# EAGLE design GPS (EAGLE 7.7.0)
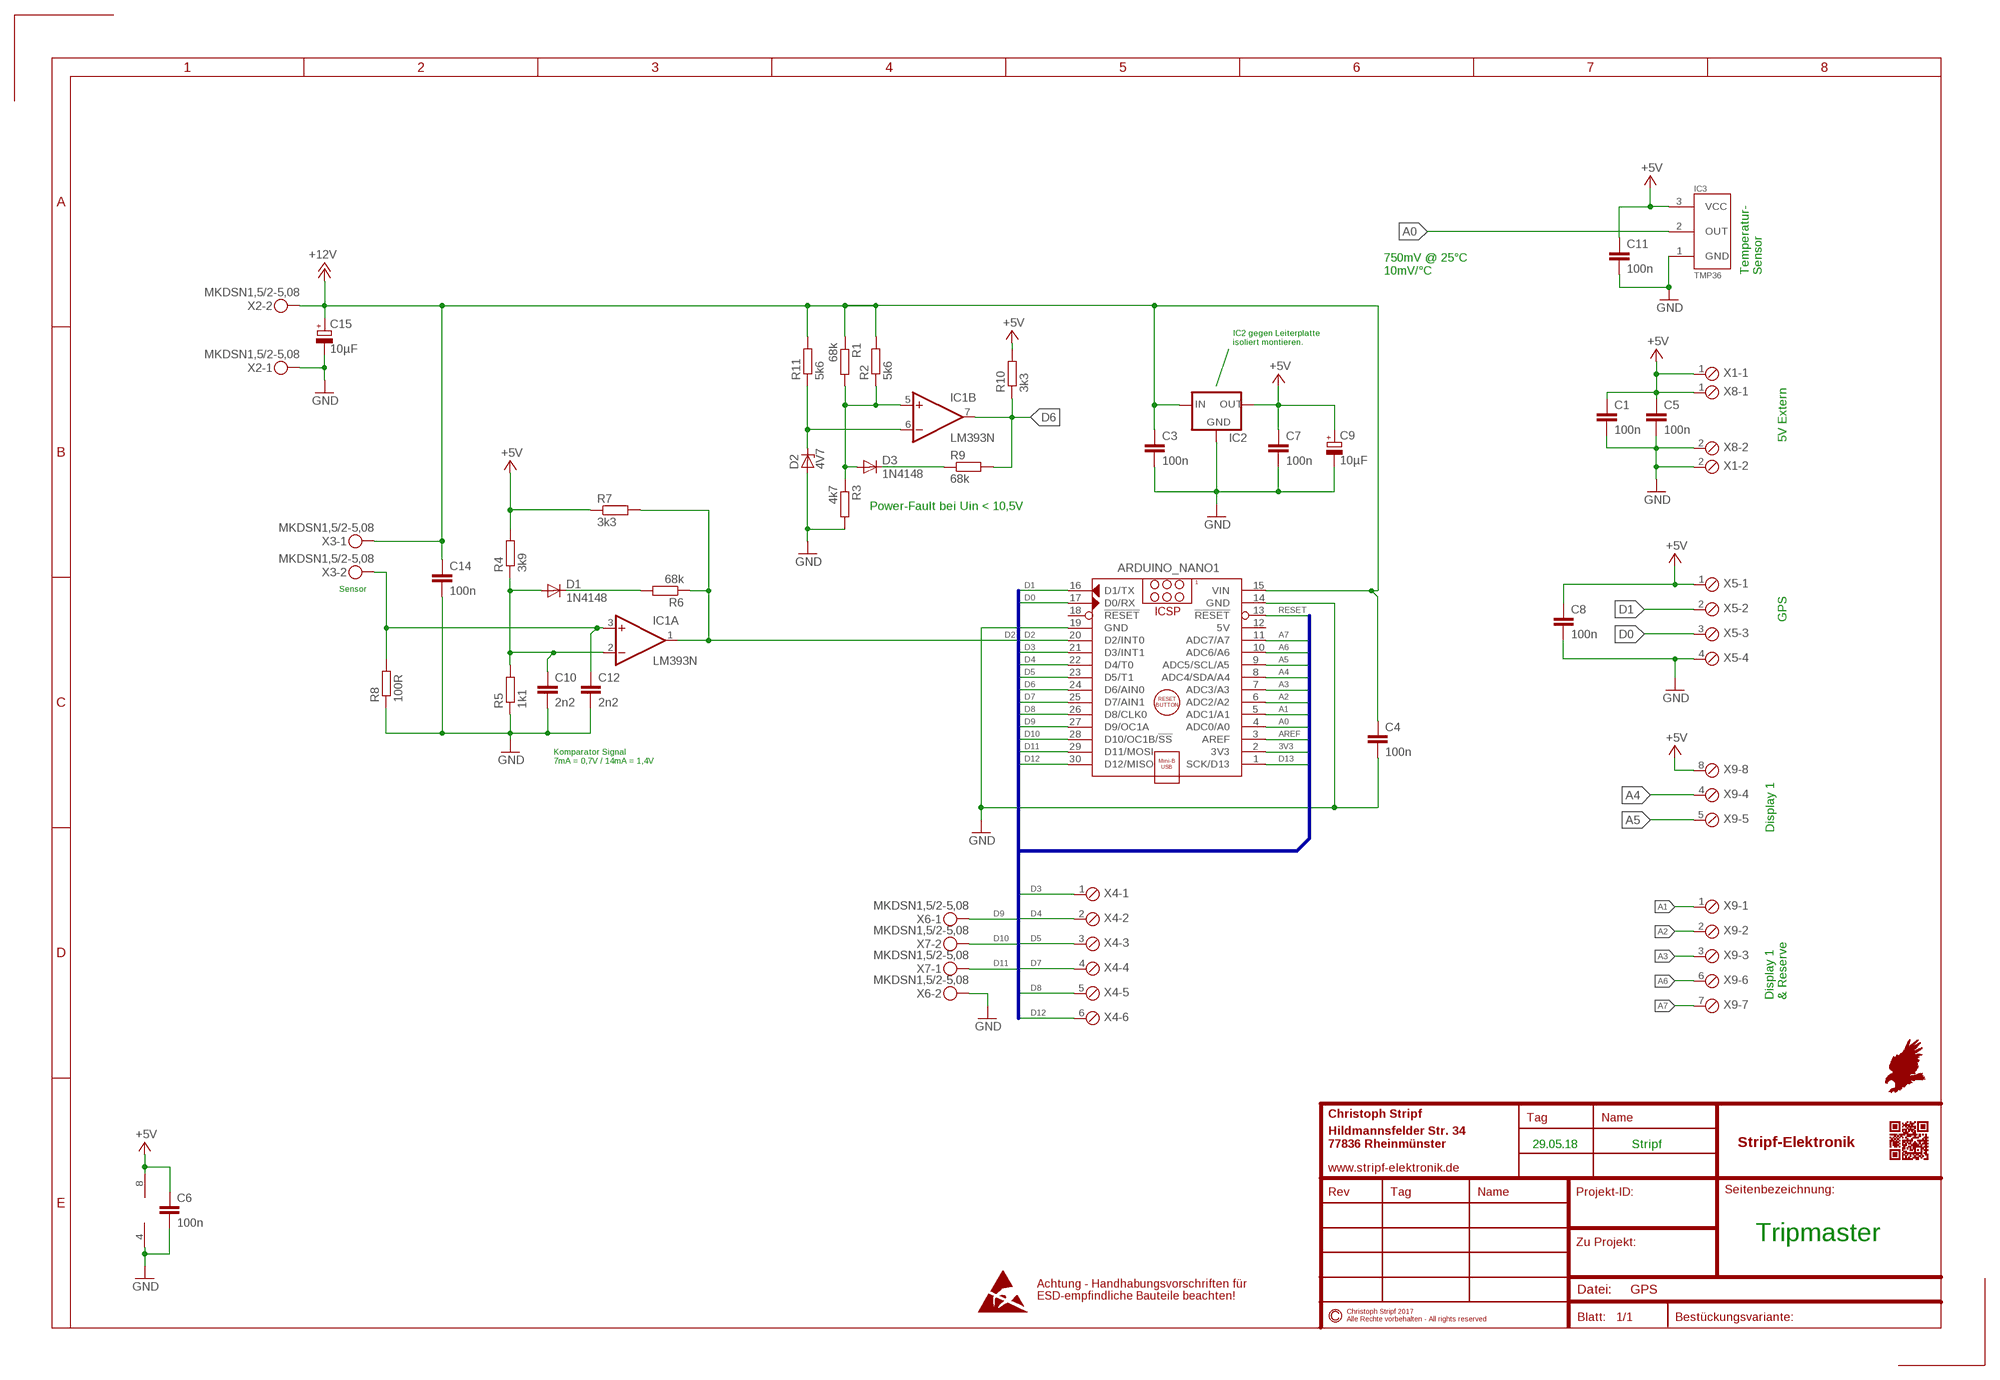
[diagram p0: schematic, sheet 1]
FRAME1 (PS_DINA-DOC): 09_RELEVANT: NO

## Parts
ARDUINO_NANO1  ARDUINO_NANO  [ARDUINO_NANO]
C1  100n  C-EU025-030X050  [C025-030X050]
C3  100n  C-EU025-030X050  [C025-030X050]
C4  100n  C-EU025-030X050  [C025-030X050]
C5  100n  C-EU025-030X050  [C025-030X050]
C6  100n  C-EU025-030X050  [C025-030X050]
C7  100n  C-EU025-030X050  [C025-030X050]
C8  100n  C-EU025-030X050  [C025-030X050]
C9  10µF  CPOL-EUE2.5-6  [E2,5-6]
C10  2n2  C-EU025-030X050  [C025-030X050]
C11  100n  C-EU025-030X050  [C025-030X050]
C12  2n2  C-EU025-030X050  [C025-030X050]
C14  100n  C-EU025-030X050  [C025-030X050]
C15  10µF  CPOL-EUE2.5-6  [E2,5-6]
D1  1N4148  1N4148DO35-7  [DO35-7]
D2  4V7  ZENER-DIODEZD-2.5  [ZDIO-2.5]
D3  1N4148  1N4148DO35-7  [DO35-7]
IC1  LM393N  [DIL08]
IC2  78XXL  [78XXL]
IC3  TMP36  [TO92-LINE]
R1  68k  R-EU_0207/2V  [0207/2V]
R2  5k6  R-EU_0207/2V  [0207/2V]
R3  4k7  R-EU_0207/2V  [0207/2V]
R4  3k9  R-EU_0207/2V  [0207/2V]
R5  1k1  R-EU_0207/2V  [0207/2V]
R6  68k  R-EU_0207/2V  [0207/2V]
R7  3k3  R-EU_0207/2V  [0207/2V]
R8  100R  R-EU_0207/2V  [0207/2V]
R9  68k  R-EU_0207/2V  [0207/2V]
R10  3k3  R-EU_0207/2V  [0207/2V]
R11  5k6  R-EU_0207/2V  [0207/2V]
X1  MPT2  [2POL254]
X2  MKDSN1,5/2-5,08  [MKDSN1,5/2-5,08]
X3  MKDSN1,5/2-5,08  [MKDSN1,5/2-5,08]
X4  MPT6  [6POL254]
X5  MPT4  [4POL254]
X6  MKDSN1,5/2-5,08  [MKDSN1,5/2-5,08]
X7  MKDSN1,5/2-5,08  [MKDSN1,5/2-5,08]
X8  MPT2  [2POL254]
X9  MPT8  [8POL254]

## Nets
3V3: ARDUINO_NANO1.2(3V3)
+5V: C1.1 C5.1 C6.1 C7.1 C8.1 C9.+ C11.1 IC1.8(P:V+) IC2.OUT IC3.3(VCC) R4.2 R7.1 R10.2 X1.1 X5.1 X8.1 X9.8
+12V: ARDUINO_NANO1.15(VIN) C3.1 C4.1 C14.1 C15.+ IC2.IN R1.1 R2.2 R11.2 X2.2 X3.1
A0: ARDUINO_NANO1.4(ADC0/A0) IC3.2(OUT)
A1: ARDUINO_NANO1.5(ADC1/A1) X9.1
A2: ARDUINO_NANO1.6(ADC2/A2) X9.2
A3: ARDUINO_NANO1.7(ADC3/A3) X9.3
A4: ARDUINO_NANO1.8(ADC4/SDA/A4) X9.4
A5: ARDUINO_NANO1.9(ADC5/SCL/A5) X9.5
A6: ARDUINO_NANO1.10(ADC6/A6) X9.6
A7: ARDUINO_NANO1.11(ADC7/A7) X9.7
AREF: ARDUINO_NANO1.3(AREF)
D0: ARDUINO_NANO1.17(D0/RX) X5.3
D1: ARDUINO_NANO1.16(D1/TX) X5.2
D2: ARDUINO_NANO1.20(D2/INT0) IC1.1(A:OUT) R6.1 R7.2
D3: ARDUINO_NANO1.21(D3/INT1) X4.1
D4: ARDUINO_NANO1.22(D4/T0) X4.2
D5: ARDUINO_NANO1.23(D5/T1) X4.3
D6: ARDUINO_NANO1.24(D6/AIN0) IC1.7(B:OUT) R9.2 R10.1
D7: ARDUINO_NANO1.25(D7/AIN1) X4.4
D8: ARDUINO_NANO1.26(D8/CLK0) X4.5
D9: ARDUINO_NANO1.27(D9/OC1A) X6.1
D10: ARDUINO_NANO1.28(D10/OC1B/!SS) X7.2
D11: ARDUINO_NANO1.29(D11/MOSI) X7.1
D12: ARDUINO_NANO1.30(D12/MISO) X4.6
D13: ARDUINO_NANO1.1(SCK/D13)
GND: ARDUINO_NANO1.14(GND) ARDUINO_NANO1.19(GND) C1.2 C3.2 C4.2 C5.2 C6.2 C7.2 C8.2 C9.- C10.2 C11.2 C12.2 C14.2 C15.- D2.A IC1.4(P:V-) IC2.GND IC3.1(GND) R3.2 R5.1 R8.1 X1.2 X2.1 X5.4 X6.2 X8.2
N$2: D3.A IC1.5(B:+IN) R1.2 R2.1 R3.1
N$3: D3.C R9.1
N$5: D2.C IC1.6(B:-IN) R11.1
N$7: D1.C R6.2
N$8: C10.1 D1.A IC1.2(A:-IN) R4.1 R5.2
N$10: C12.1 IC1.3(A:+IN) R8.2 X3.2
RESET: ARDUINO_NANO1.13(!RESET)
Unconnected: ARDUINO_NANO1.18(!RESET)

## Buses
NANO:D[0..13],A[0..7],RESET,AREF,3V3,5V,VIN

## Notes on the sheet
- 750mV @ 25°C
  10mV/°C
- Temperatur-
  Sensor
- IC2 gegen Leiterplatte 
  isoliert montieren.
- 5V Extern
- Power-Fault bei Uin < 10,5V
- Sensor
- GPS
- Komparator Signal
  7mA = 0,7V / 14mA = 1,4V
- Display 1
- Display 1
  & Reserve
- 29.05.18 | Stripf
- Tripmaster

## Power pins joined to a net without a drawn wire
5V: ARDUINO_NANO1.12(5V)

## Library data of the parts
ARDUINO_NANO1 = ArduinoNanoV30:ARDUINO_NANO: Arduino Nano V3.0 Module Overview: The Arduino Nano is a small, complete, and breadboard-friendly board based on the ATmega328 (Arduino Nano 3.x) or ATmega168 (Arduino Nano 2.x). It has more or less the same functionality of the Arduino Duemilanove, but in a different package. It lacks only a DC power jack, and works with a Mini-B USB cable instead of a standard one. The Nano was designed and is being produced by Gravitech <http://www.gravitech.us/arna30wiatp.html>. General specifications: Item Value Microcontroller Atmel ATmega168 or ATmega328 Operating Voltage (logic level) 5 V Input Voltage (recommended) 7-12 V Input Voltage (limits) 6-20 V Digital I/O Pins 14 (of which 6 provide PWM output) Analog Input Pins 8 DC Current per I/O Pin 40 mA Flash Memory 16 KB (ATmega168) or 32 KB (ATmega328) of which 2 KB used by bootloader SRAM 1 KB (ATmega168) or 2 KB (ATmega328) EEPROM 512 bytes (ATmega168) or 1 KB (ATmega328) Clock Speed 16 MHz Dimensions (Inches) 0.73" x 1.70" Dimensions (mm) 18mm x 45mm Overall height About 9 mm (not including pins) Weigth 5 g Power: The Arduino Nano can be powered via the Mini-B USB connection, 6-20V unregulated external power supply (pin 30), or 5V regulated external power supply (pin 27). The power source is automatically selected to the highest voltage source. Memory: The ATmega168 has 16 KB of flash memory for storing code (of which 2 KB is used for the bootloader); the ATmega328 has 32 KB, (also with 2 KB used for the bootloader). The ATmega168 has 1 KB of SRAM and 512 bytes of EEPROM (which can be read and written with the EEPROM library); the ATmega328 has 2 KB of SRAM and 1 KB of EEPROM. Input and Output: Each of the 14 digital pins on the Nano can be used as an input or output, using pinMode(), digitalWrite(), and digitalRead() functions. They operate at 5 volts. Each pin can provide or receive a maximum of 40 mA and has an internal pull-up resistor (disconnected by default) of 20-50 kOhms. In addition, some pins have specialized functions. Visit Arduino - ArduinoBoardNano <https://www.arduino.cc/en/Main/ArduinoBoardNano>
C1 C3-C8 C10-C12 C14 = rcl:C-EU: CAPACITOR, European symbol
C9 C15 = rcl:CPOL-EU: POLARIZED CAPACITOR, European symbol
D1 D3 = diode:1N4148: DIODE high speed (Philips)
D2 = diode:ZENER-DIODE: Z-Diode
IC1 = linear2:LM393: COMPARATOR
IC2 = v-reg:78XXL: VOLTAGE REGULATOR
IC3 = Stripf:TMP36
R1-R11 = rcl:R-EU_: RESISTOR, European symbol
X1 X8 = con-phoenix-254:MPT2: PHOENIX CONNECTOR; OC_FARNELL: unknown; OC_NEWARK: unknown
X2 X3 X6 X7 = con-phoenix-508:MKDSN1,5/2-5,08: MKDSN 1,5/ 2-5,08 Printklemme Nennstrom: 13,5 A Nennspannung: 250 V Rastermaß: 5,08 mm Polzahl: 2 Anschlussart: Schraubanschluss Montage: Löten Anschlussrichtung Leiter/Platine: 0 ° Artikelnummer: 1729128 Source: http://eshop.phoenixcontact.com .. 1729128.pdf
X4 = con-phoenix-254:MPT6: PHOENIX CONNECTOR; OC_FARNELL: unknown; OC_NEWARK: unknown
X5 = con-phoenix-254:MPT4: PHOENIX CONNECTOR; OC_FARNELL: unknown; OC_NEWARK: unknown
X9 = con-phoenix-254:MPT8: PHOENIX CONNECTOR; OC_FARNELL: unknown; OC_NEWARK: unknown

## Board
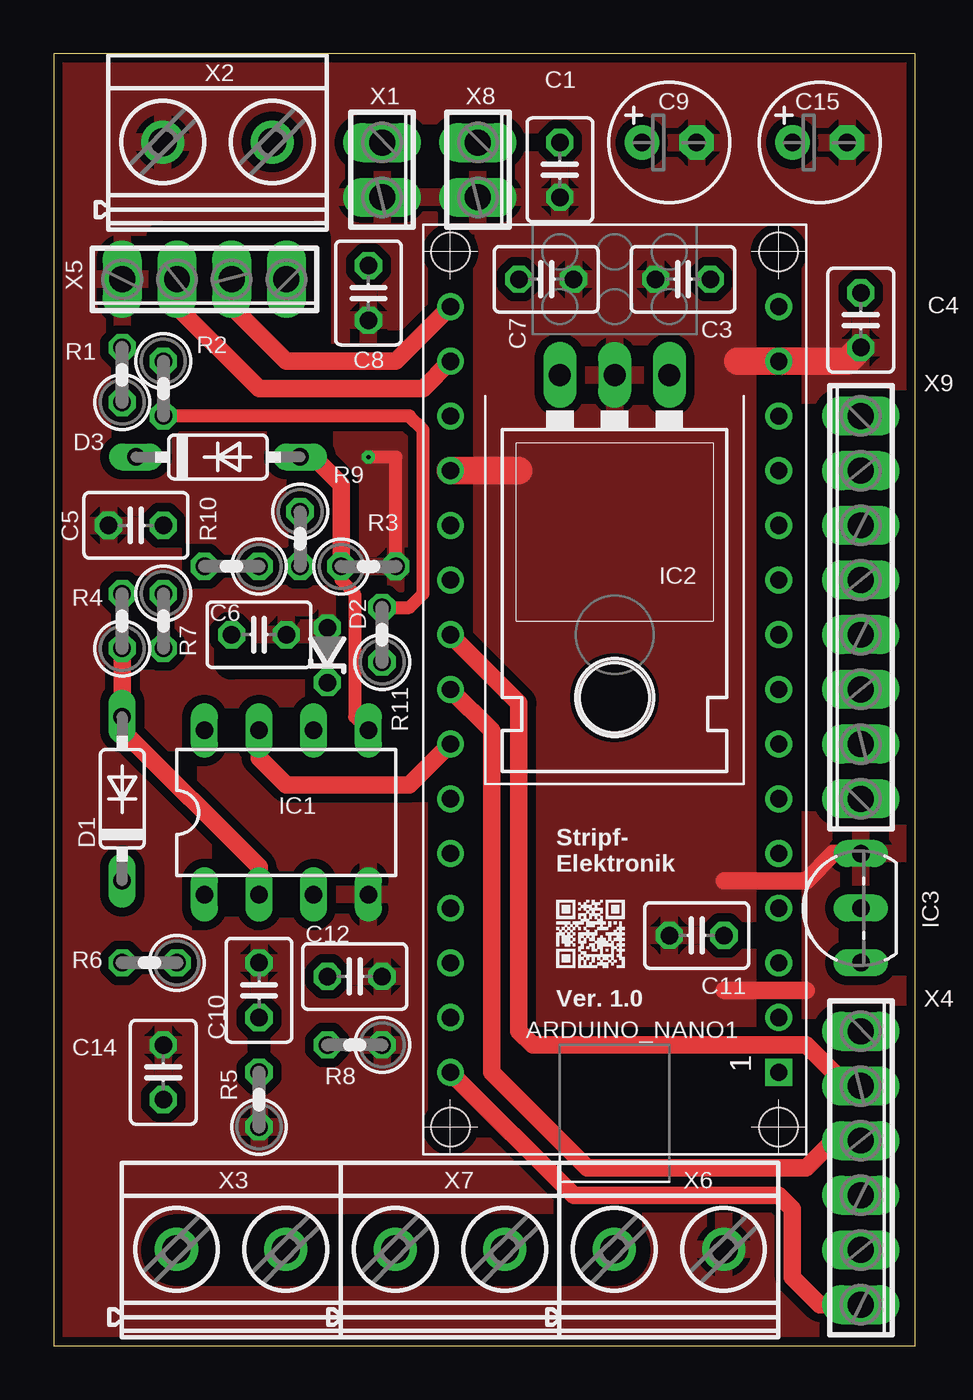
[diagram p1: board, top side]
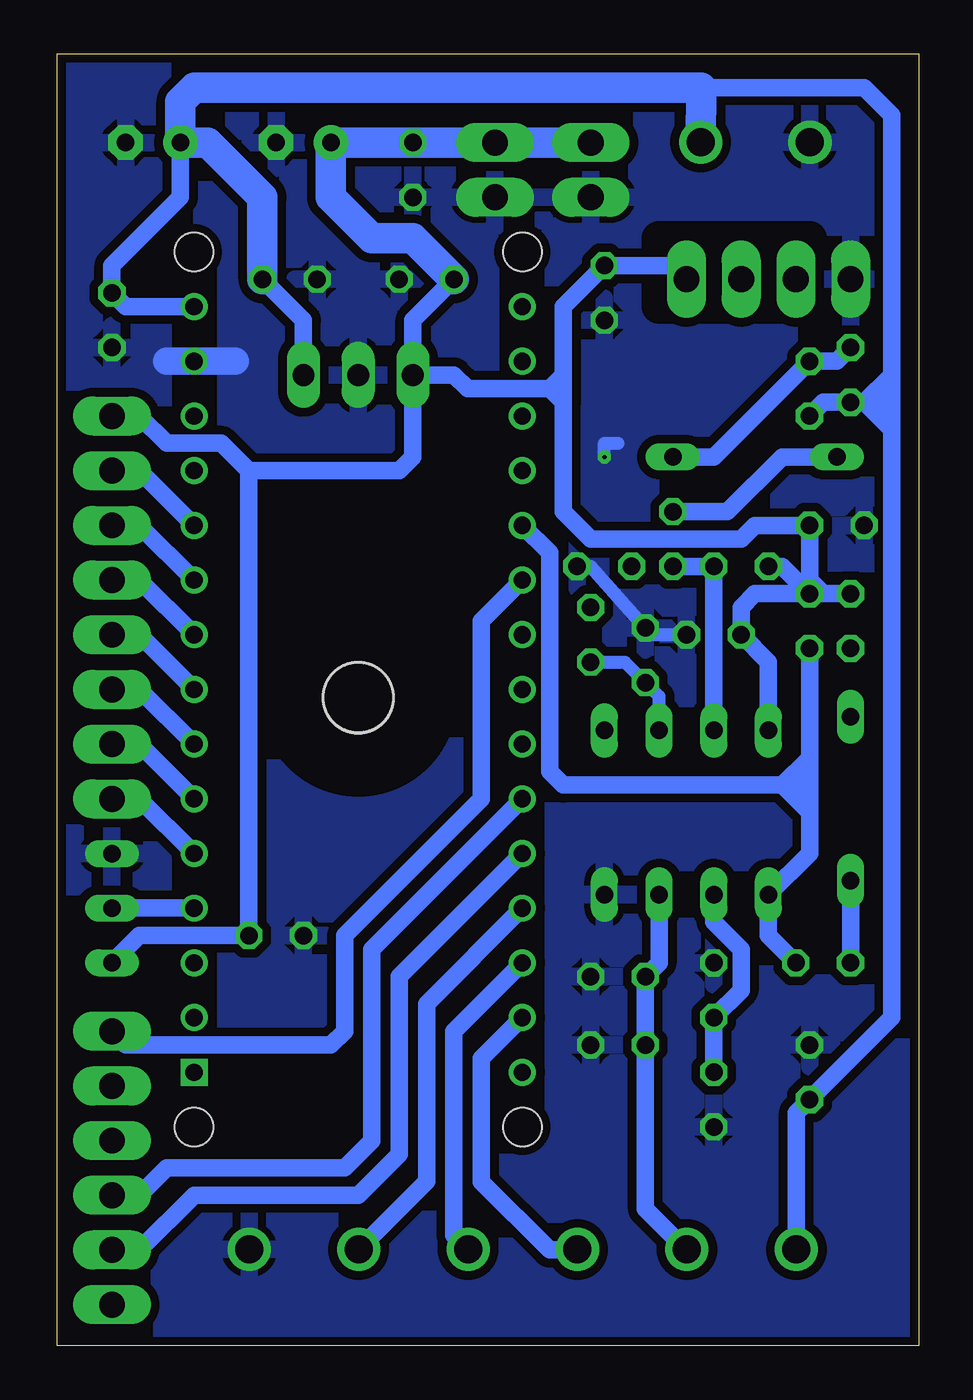
[diagram p2: board, bottom side, seen from below]

Size 40 x 60 mm. Coordinates in mm from the lower left corner, seen from the top.
Outline: 0,0 40,0 40,60 0,60 0,0
Copper layers (1+16): Top 0.035mm / dielectric 0.2mm / Bottom 0.035mm
Design rules "Eagle_WEdirekt_150_check *": minimum track width 0.15mm, minimum drill 0.2mm, track to track 0.15mm, track to pad 0.15mm, pad to pad 0.2mm, via to via 0.15mm, smd to smd 0.2mm, copper to edge 0.3mm, drill to drill 0.6mm, minimum pad ring 0.225mm, minimum via ring 0.2mm, stop-mask expansion 0.075mm, vias tented up to drill 0mil, thermal gap 0.3mm
tRestrict: 8 lines
bRestrict: 5 lines

### Footprints (pad centres in the part's own frame; a part is rotated, then mirrored left to right if it is on the bottom)
ARDUINO_NANO = drill 0.8 square: 1 -20.32,-7.62 | drill 0.8: 2 -17.78,-7.62; 3 -15.24,-7.62; 4 -12.7,-7.62; 5 -10.16,-7.62; 6 -7.62,-7.62; 7 -5.08,-7.62; 8 -2.54,-7.62; 9 0,-7.62; 10 2.54,-7.62; 11 5.08,-7.62; 12 7.62,-7.62; 13 10.16,-7.62; 14 12.7,-7.62; 15 15.24,-7.62; 16 15.24,7.62; 17 12.7,7.62; 18 10.16,7.62; 19 7.62,7.62; 20 5.08,7.62; 21 2.54,7.62; 22 0,7.62; 23 -2.54,7.62; 24 -5.08,7.62; 25 -7.62,7.62; 26 -10.16,7.62; 27 -12.7,7.62; 28 -15.24,7.62; 29 -17.78,7.62; 30 -20.32,7.62 | hole 1.778: -22.86,-7.62; -22.86,7.62; 17.78,7.62; 17.78,-7.62
C025-030X050 = drill 0.813 octagon: 1 -1.27,0; 2 1.27,0
E2,5-6 = drill 0.813 pad 1.6: + -1.27,0 | drill 0.813 pad 1.6 octagon: - 1.27,0
DO35-7 = drill 0.813 long: A 3.81,0; C -3.81,0
ZDIO-2.5 = drill 0.813 octagon: A 1.27,0; C -1.27,0
DIL08 = drill 0.813 long: 1 -3.81,-3.81; 2 -1.27,-3.81; 3 1.27,-3.81; 4 3.81,-3.81; 5 3.81,3.81; 6 1.27,3.81; 7 -1.27,3.81; 8 -3.81,3.81
78XXL = drill 1.016 long: GND 0,-3.81; IN -2.54,-3.81; OUT 2.54,-3.81 | hole 3.302: 0,11.176 | hole 3.2: 0,11.176
TO92-LINE = drill 0.813 long: 1 2.54,0; 2 0,0; 3 -2.54,0
0207/2V = drill 0.813 octagon: 1 -1.27,0; 2 1.27,0
2POL254 = drill 1.2 long: 1 -1.27,0; 2 1.27,0
MKDSN1,5/2-5,08 = drill 1.3 pad 2: 1 -2.561,0.025; 2 2.519,0.025
6POL254 = drill 1.2 pad 1.778 long: 1 -6.35,0; 2 -3.81,0; 3 -1.27,0; 4 1.27,0; 5 3.81,0; 6 6.35,0
4POL254 = drill 1.2 long: 1 -3.81,0; 2 -1.27,0; 3 1.27,0; 4 3.81,0
8POL254 = drill 1.2 long: 1 -8.89,0; 2 -6.35,0; 3 -3.81,0; 4 -1.27,0; 5 1.27,0; 6 3.81,0; 7 6.35,0; 8 8.89,0

### Placement (x,y rotation side)
ARDUINO_NANO1  26.04,33.02 90 top
C1  23.5,54.61 270 top
C3  29.21,49.53 180 top
C4  37.47,47.62 270 top
C5  3.81,38.1 180 top
C6  9.53,33.02 0 top
C7  22.86,49.53 0 top
C8  14.61,48.9 270 top
C9  28.57,55.88 0 top
C10  9.53,16.51 90 top
C11  29.84,19.05 180 top
C12  13.97,17.14 0 top
C14  5.08,12.7 90 top
C15  35.56,55.88 0 top
D1  3.17,25.4 90 top
D2  12.7,32.07 90 top
D3  7.62,41.27 0 top
IC1  10.79,24.77 0 top
IC2  26.04,41.27 180 top
IC3  37.47,20.32 90 top
R1  3.17,45.09 90 top
R2  5.08,44.45 270 top
R3  14.61,36.2 0 top
R4  3.17,33.66 90 top
R5  9.53,11.43 90 top
R6  4.45,17.78 180 top
R7  5.08,33.66 270 top
R8  13.97,13.97 180 top
R9  11.43,37.47 270 top
R10  8.26,36.2 180 top
R11  15.24,33.02 90 top
U$1  [QR-CODE-SMALL]  23.32,17.53 0 top
U$3  [GLIMMER_TO220]  26.04,41.27 180 top
X1  15.24,54.61 270 top
X2  7.62,55.88 0 top
X3  8.26,4.45 0 top
X4  37.47,8.26 270 top
X5  6.99,49.53 180 top
X6  28.57,4.45 0 top
X7  18.41,4.45 0 top
X8  19.68,54.61 270 top
X9  37.47,34.29 90 top

### Tracks (layer width: path | path; a pad name or v marks a point on that pad's centre or on a via)
+5V
  Bottom 0.813: R4.2 4.45,34.92 | 5.08,35.56 C5.1 7.62,38.1 8.26,37.47 15.24,37.47 16.51,38.73 16.51,43.81 | 5.08,35.56 R7.1 | 5.71,34.92 7.62,34.92 8.26,34.29 C6.1 6.99,31.75 IC1.8 | 5.08,35.56 4.45,34.92 | 4.45,34.92 R7.1 | R7.1 5.71,34.92 | 5.71,34.92 5.08,35.56 | R10.2 6.35,36.2 R7.1 | IC2.OUT 23.5,47.62 C7.1 | 16.51,43.81 16.51,44.45 | 31.11,40.64 24.13,40.64 23.5,41.27 IC2.OUT | 31.11,40.64 C11.1 36.2,19.05 IC3.3 | X5.1 11.43,50.16 C8.1 16.51,48.26 16.51,45.09 | 16.51,45.09 16.51,44.45 | 16.51,44.45 17.14,44.45 | 17.14,44.45 20.95,44.45 21.59,45.09 IC2.OUT | 16.51,43.81 17.14,44.45 | 17.14,44.45 16.51,45.09 | 31.11,40.64 32.38,41.91 34.92,41.91 36.2,43.18 X9.8
  Bottom 1.422: X1.1 X8.1 C1.1 C9.+ 27.3,53.34 25.4,51.44 23.5,51.44 C7.1
+12V
  Top 0.61: R11.2 16.51,34.29 17.14,34.92 17.14,42.55 16.51,43.18 R2.2
  Bottom 0.813: 1.27,45.09 1.27,57.15 2.54,58.42 10.11,58.42 10.16,58.42 10.16,55.93 X2.2 10.16,55.88 | 1.27,45.09 1.27,43.81 | 1.27,43.81 1.27,42.55 | 1.27,42.55 1.27,15.24 C14.1 5.69,10.82 X3.1 | IC2.IN 28.57,47.62 C3.1 | 2.54,43.81 R1.1 4.45,43.81 R2.2 | 2.54,43.81 1.27,45.09 | 2.54,43.81 1.27,42.55 | 2.54,43.81 1.27,43.81 | ARDUINO_NANO1.15 36.83,48.26 C4.1 37.47,50.16 34.29,53.34 C15.+
  Bottom 1.422: C3.1 30.48,53.34 33.02,55.88 C15.+ 34.29,57.78 33.66,58.42 10.11,58.42 X2.2 10.16,55.88
A0
  Bottom 0.813: ARDUINO_NANO1.4 IC3.2
A1
  Bottom 0.813: ARDUINO_NANO1.5 36.2,25.4 X9.1
A2
  Bottom 0.813: ARDUINO_NANO1.6 36.2,27.94 X9.2
A3
  Bottom 0.813: ARDUINO_NANO1.7 36.2,30.48 X9.3
A4
  Bottom 0.813: ARDUINO_NANO1.8 36.2,33.02 X9.4
A5
  Bottom 0.813: ARDUINO_NANO1.9 36.2,35.56 X9.5
A6
  Bottom 0.813: ARDUINO_NANO1.10 36.2,38.1 X9.6
A7
  Bottom 0.813: ARDUINO_NANO1.11 36.2,40.64 X9.7
D0
  Top 0.813: X5.3 5.71,48.26 9.53,44.45 17.14,44.45 ARDUINO_NANO1.17
D1
  Top 0.813: X5.2 8.26,48.26 10.79,45.72 15.88,45.72 ARDUINO_NANO1.16
D2
  Bottom 0.813: 5.08,25.4 R7.2 5.08,27.3 6.35,26.04 | 5.08,24.77 5.08,22.86 IC1.1 6.99,19.05 R6.1 | 6.35,26.04 5.71,26.04 5.08,25.4 | 5.08,25.4 5.08,24.77 | 5.08,24.77 6.35,26.04 | 6.35,26.04 16.51,26.04 17.14,26.67 17.14,36.83 ARDUINO_NANO1.20
D3
  Bottom 0.813: X4.1 36.83,13.97 27.3,13.97 26.67,14.61 26.67,19.05 20.32,25.4 20.32,33.66 ARDUINO_NANO1.21
D4
  Top 0.813: X4.2 36.83,12.06 34.92,13.97 22.23,13.97 21.59,14.61 21.59,29.84 ARDUINO_NANO1.22
D5
  Top 0.813: X4.3 36.2,9.53 34.92,8.26 24.77,8.26 20.32,12.7 20.32,28.57 ARDUINO_NANO1.23
D6
  Top 0.813: IC1.7 9.53,27.3 10.79,26.04 16.51,26.04 ARDUINO_NANO1.24
  Bottom 0.813: IC1.7 R10.1 R9.2
D7
  Bottom 0.813: ARDUINO_NANO1.25 25.4,18.41 25.4,9.53 26.67,8.26 34.92,8.26 36.2,6.99 X4.4
D8
  Bottom 0.813: ARDUINO_NANO1.26 24.13,17.14 24.13,8.89 26.04,6.99 33.66,6.99 36.2,4.45 X4.5
D9
  Bottom 0.813: ARDUINO_NANO1.27 22.86,15.88 22.86,7.62 X6.1
D10
  Bottom 0.813: ARDUINO_NANO1.28 21.59,14.61 21.59,5.13 X7.2
D11
  Bottom 0.813: ARDUINO_NANO1.29 20.32,13.34 20.32,7.62 17.14,4.45 15.88,4.45 X7.1
D12
  Top 0.813: X4.6 35.56,1.91 34.29,3.17 34.29,6.35 33.66,6.99 24.13,6.99 ARDUINO_NANO1.30
GND  (via drill 0.2)
  Top 0.61: R3.2 15.88,41.27 v14.61,41.27
  Top 0.813: IC3.1 36.2,22.86 34.92,21.59 31.11,21.59 | 34.92,16.51 31.11,16.51
  Top 1.27: ARDUINO_NANO1.19 21.59,40.64 | C4.2 36.83,45.72 ARDUINO_NANO1.14 31.75,45.72
  Bottom 0.61: C6.2 12.38,33.02 D2.A 15.24,36.2 R3.2 | v14.61,41.27 14.61,41.91 13.97,41.91
  Bottom 1.27: 31.75,45.72 34.92,45.72
  pour Top (isolate 0.406): 0,60.33 40.01,60.33 40.01,0 0,0
  pour Bottom (isolate 0.406): 0,60.33 40.01,60.33 40.01,0 0,0
N$2
  Top 0.61: R3.1 13.34,35.56 13.97,34.92 13.97,29.21 IC1.5
  Top 0.813: D3.A 12.06,41.27 13.34,40.01 R3.1
  Bottom 0.813: R1.2 3.81,45.72 R2.1 9.53,41.27 D3.A
N$3
  Bottom 0.813: D3.C 6.35,41.27 8.89,38.73 R9.1
N$5
  Bottom 0.61: R11.1 13.65,31.75 D2.C 12.06,30.16 IC1.6
N$7
  Bottom 0.813: D1.C R6.2
N$8
  Top 0.813: R4.1 D1.A 3.17,28.57 9.53,22.23 IC1.2
  Bottom 0.813: IC1.2 9.53,19.68 8.26,18.41 8.26,16.51 C10.1 R5.2
N$10
  Bottom 0.813: IC1.3 12.06,17.78 C12.1 R8.2 12.7,6.35 10.77,4.42 X3.2

### Text on the board
tPlace: Stripf- / Elektronik | Ver. 1.0
Belegung: Belegung / X1 & X8: | 1 | GND | GND | GND | D0 | D1 | +5V | Belegung X5: | 1 | +5V | A7 | A6 | A5 | A4 | A3 | A2 | A1 | D3 | D4 | D5 | D7 | D8 | D12 | Signal (Sensor) | D11 | D10 | D9 | GND | +12V (Sensor)